# EAGLE design FINAL PROJECT (EAGLE 9.6.2)
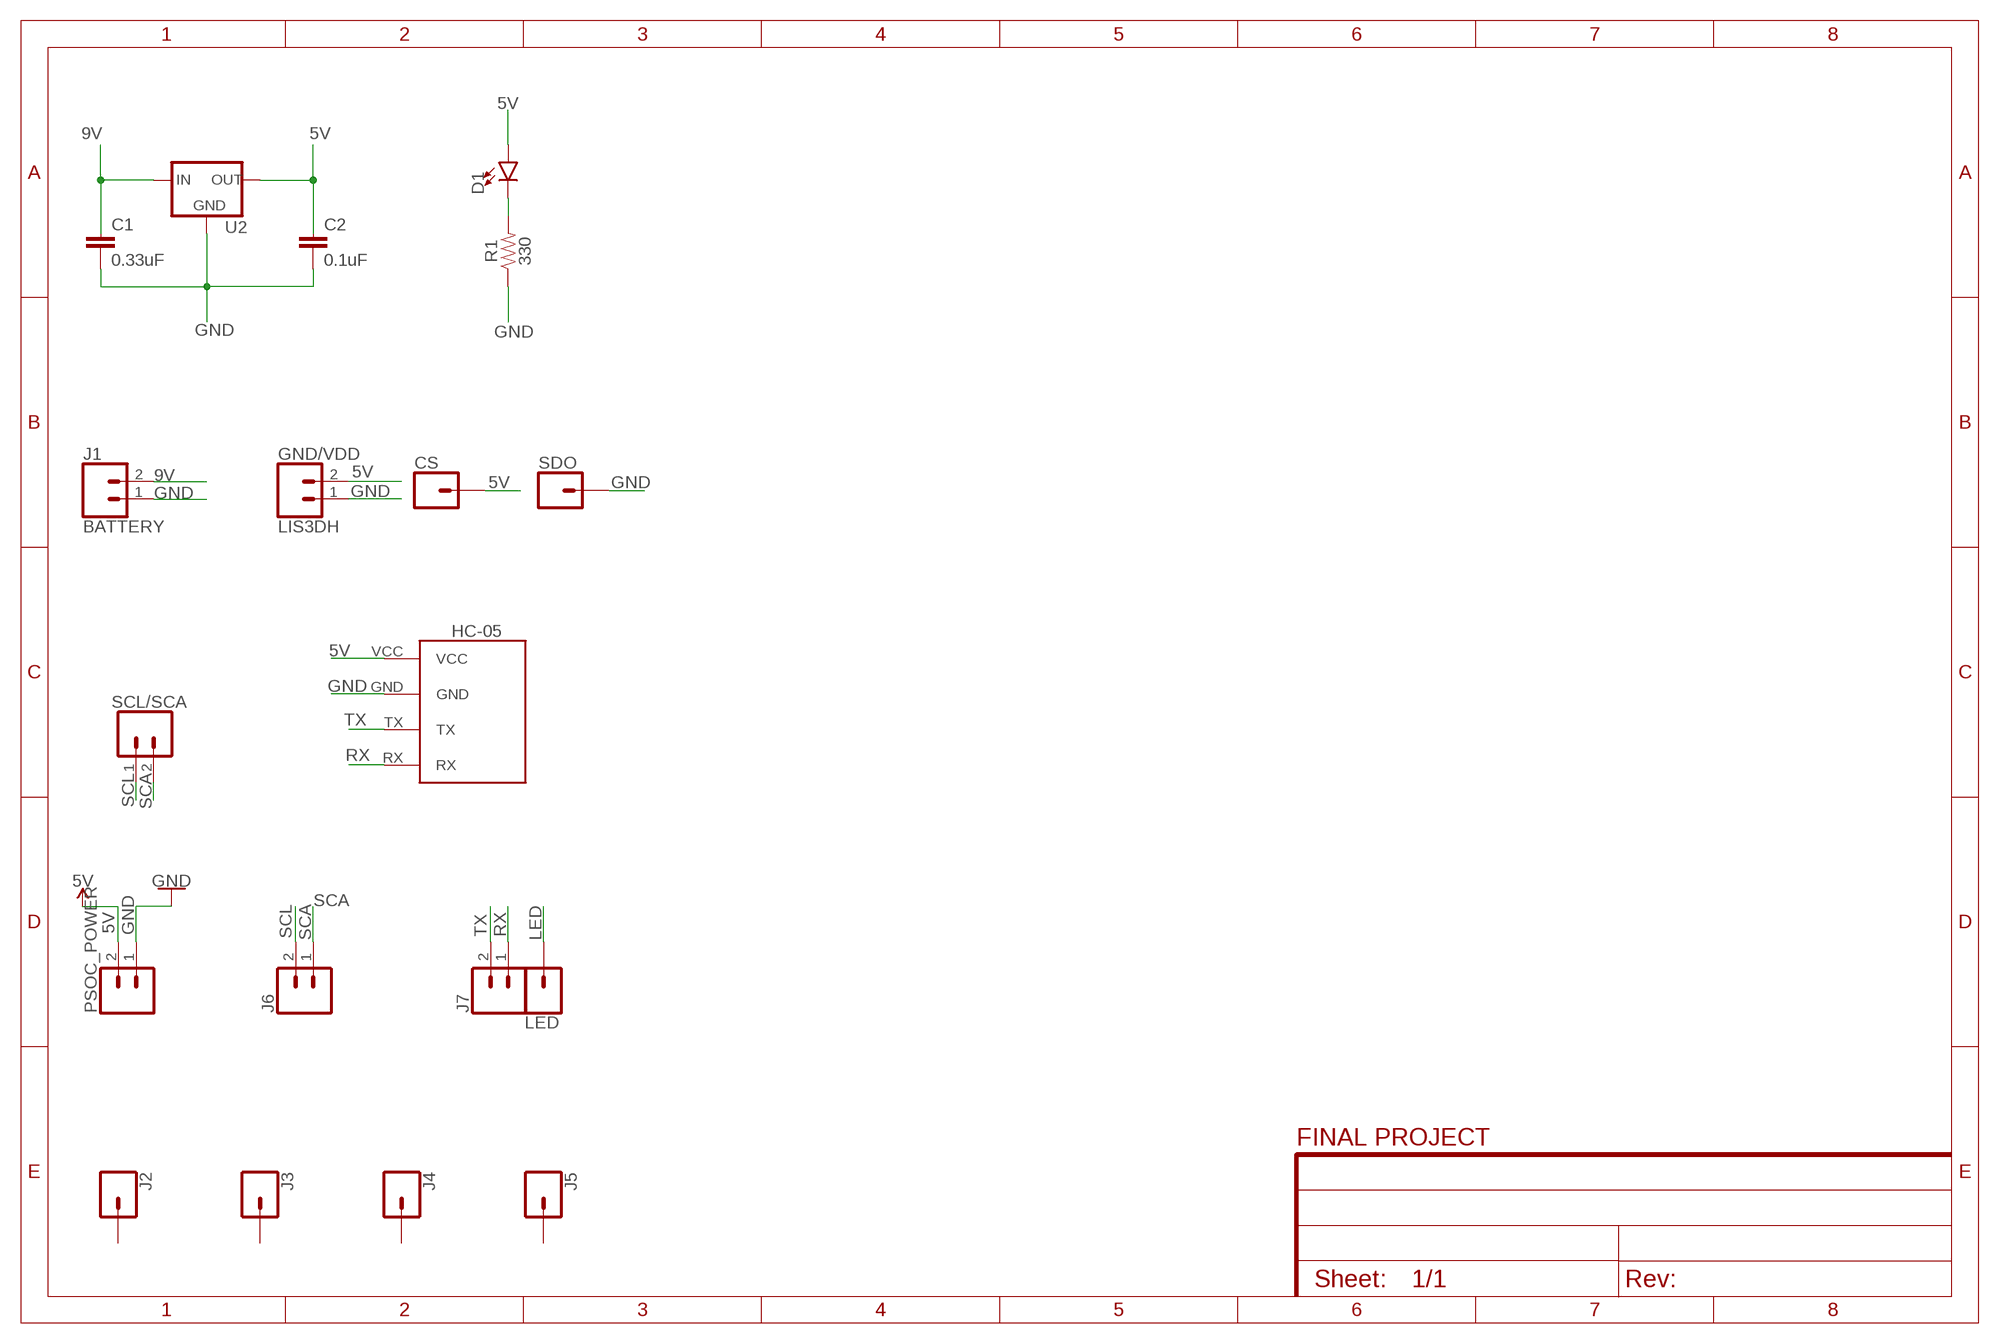
[diagram p0: schematic, sheet 1]

## Parts
C1  0.33uF  0.1UF-KIT-EZ-50V-20%  [CAP-PTH-SMALL-KIT]
C2  0.1uF  0.1UF-KIT-EZ-50V-20%  [CAP-PTH-SMALL-KIT]
CS  CONN_01  [1X01]
D1  LED3MM  [LED_3MM]
GND/VDD  LIS3DH  CONN_02  [1X02]
HC-05  BLUETOOTH_BOARD  [BT_BOARD_FOOTPRINT]
J1  BATTERY  CONN_02  [1X02]
J2  CONN_01  [1X01]
J3  CONN_01  [1X01]
J4  CONN_01  [1X01]
J5  CONN_01  [1X01]
J6  CONN_02  [1X02]
J7  CONN_02  [1X02]
LED  CONN_01  [1X01]
PSOC_POWER  CONN_02  [1X02]
R1  330  330OHM-HORIZ-1/10W-5%  [AXIAL-0.3]
SCL/SCA  CONN_02  [1X02]
SDO  CONN_01  [1X01]
U2  V_REG_78XX-TO-220  [TO-220-ALT]

## Nets
5V: C2.1 CS.1 D1.A GND/VDD.2 HC-05.VCC PSOC_POWER.2 U2.OUT
9V: C1.1 J1.2 U2.IN
GND: C1.2 C2.2 GND/VDD.1 HC-05.GND J1.1 PSOC_POWER.1 R1.P$1 SDO.1 U2.GND
LED: LED.1
N$2: D1.K(C) R1.P$2
RX: HC-05.RX J7.1
SCA: J6.1 SCL/SCA.2
SCL: J6.2 SCL/SCA.1
TX: HC-05.TX J7.2
Unconnected: J2.1 J3.1 J4.1 J5.1

## Library data of the parts
C1 = SparkFun-Capacitors:0.1UF: 0.1µF ceramic capacitors A capacitor is a passive two-terminal electrical component used to store electrical energy temporarily in an electric field.; PROD_ID: CAP-08370; VALUE: 0.1uF
C2 = SparkFun-Capacitors:0.1UF: 0.1µF ceramic capacitors A capacitor is a passive two-terminal electrical component used to store electrical energy temporarily in an electric field.; PROD_ID: CAP-08370
CS J2-J5 LED SDO = SparkFun-Connectors:CONN_01: Single connection point. Often used as Generic Header-pin footprint for 0.1 inch spaced/style header connections On any of the 0.1 inch spaced packages, you can populate with these: Break Away Headers - Straight <https://www.sparkfun.com/products/116> (PRT-00116) Break Away Male Headers - Right Angle <https://www.sparkfun.com/products/553> (PRT-00553) Female Headers <https://www.sparkfun.com/products/115> (PRT-00115) Break Away Headers - Machine Pin <https://www.sparkfun.com/products/117> (PRT-00117) Break Away Female Headers - Swiss Machine Pin <https://www.sparkfun.com/products/743> (PRT-00743) This device is also useful as a general connection point to wire up your design to another part of your project. Our various solder wires solder well into these plated through hole pads. Hook-Up Wire - Assortment (Stranded, 22 AWG) <https://www.sparkfun.com/products/11375> (PRT-11375) Hook-Up Wire - Assortment (Solid Core, 22 AWG) <https://www.sparkfun.com/products/11367> (PRT-11367) View the entire wire category on our website here <https://www.sparkfun.com/categories/141> Special notes: SMTSO-256-ET is a "flush mount" nut for a 4-40 screw. We mostly use this on specialty testbeds; it is a nice way to connect hardware to your PCB at an adjustable hieght. Also note, the SNAP packages are for using a snappable style connector. We sell a baggie of snaps and they are also used on two LilyPad designs: Snap Assortment - 30 pack (male and female) <https://www.sparkfun.com/products/11347> (DEV-11347) LilyPad Arduino SimpleSnap <https://www.sparkfun.com/products/10941> (DEV-10941) LilyPad SimpleSnap Protoboard <https://www.sparkfun.com/products/10940> (DEV-10940)
D1 = SparkFun-LED:LED: LED (Generic) Standard schematic elements and footprints for 5mm, 3mm, 1206, and 0603 sized LEDs. Generic LEDs with no color specified.; PROD_ID: DIO-08794
GND/VDD J1 J6 J7 PSOC_POWER SCL/SCA = SparkFun-Connectors:CONN_02: Multi connection point. Often used as Generic Header-pin footprint for 0.1 inch spaced/style header connections On any of the 0.1 inch spaced packages, you can populate with these: Break Away Headers - Straight <https://www.sparkfun.com/products/116> (PRT-00116) Break Away Male Headers - Right Angle <https://www.sparkfun.com/products/553> (PRT-00553) Female Headers <https://www.sparkfun.com/products/115> (PRT-00115) Break Away Headers - Machine Pin <https://www.sparkfun.com/products/117> (PRT-00117) Break Away Female Headers - Swiss Machine Pin <https://www.sparkfun.com/products/743> (PRT-00743) For SCREWTERMINALS and SPRING TERMINALS visit here: Screw Terimnals on SparkFun.com <https://www.sparkfun.com/search/results?term=Screw+Terminals> (5mm/3.5mm/2.54mm spacing) This device is also useful as a general connection point to wire up your design to another part of your project. Our various solder wires solder well into these plated through hole pads. Hook-Up Wire - Assortment (Stranded, 22 AWG) <https://www.sparkfun.com/products/11375> (PRT-11375) Hook-Up Wire - Assortment (Solid Core, 22 AWG) <https://www.sparkfun.com/products/11367> (PRT-11367) View the entire wire category on our website here <https://www.sparkfun.com/categories/141> Special notes: Molex polarized connector foot print use with: PRT-08233 with associated crimp pins and housings. 2.54_SCREWTERM for use with PRT-10571. 3.5mm Screw Terminal footprints for PRT-08084 5mm Screw Terminal footprints for use with PRT-08432
HC-05 = Bluetooth HC-05:BLUETOOTH_BOARD: Bluetooth Board V1.05
R1 = SparkFun-Resistors:330OHM: 330Ω resistor A resistor is a passive two-terminal electrical component that implements electrical resistance as a circuit element. Resistors act to reduce current flow, and, at the same time, act to lower voltage levels within circuits. - Wikipedia; PROD_ID: RES-8371
U2 = SparkFun-IC-Power:V_REG_78XX: Voltage Regulator Standard 78xx regulator. IGO (Input Ground Output). Spark Fun Electronics SKU : COM-00107; PROD_ID: VREG-08450; SF_ID: COM-00107

## Board
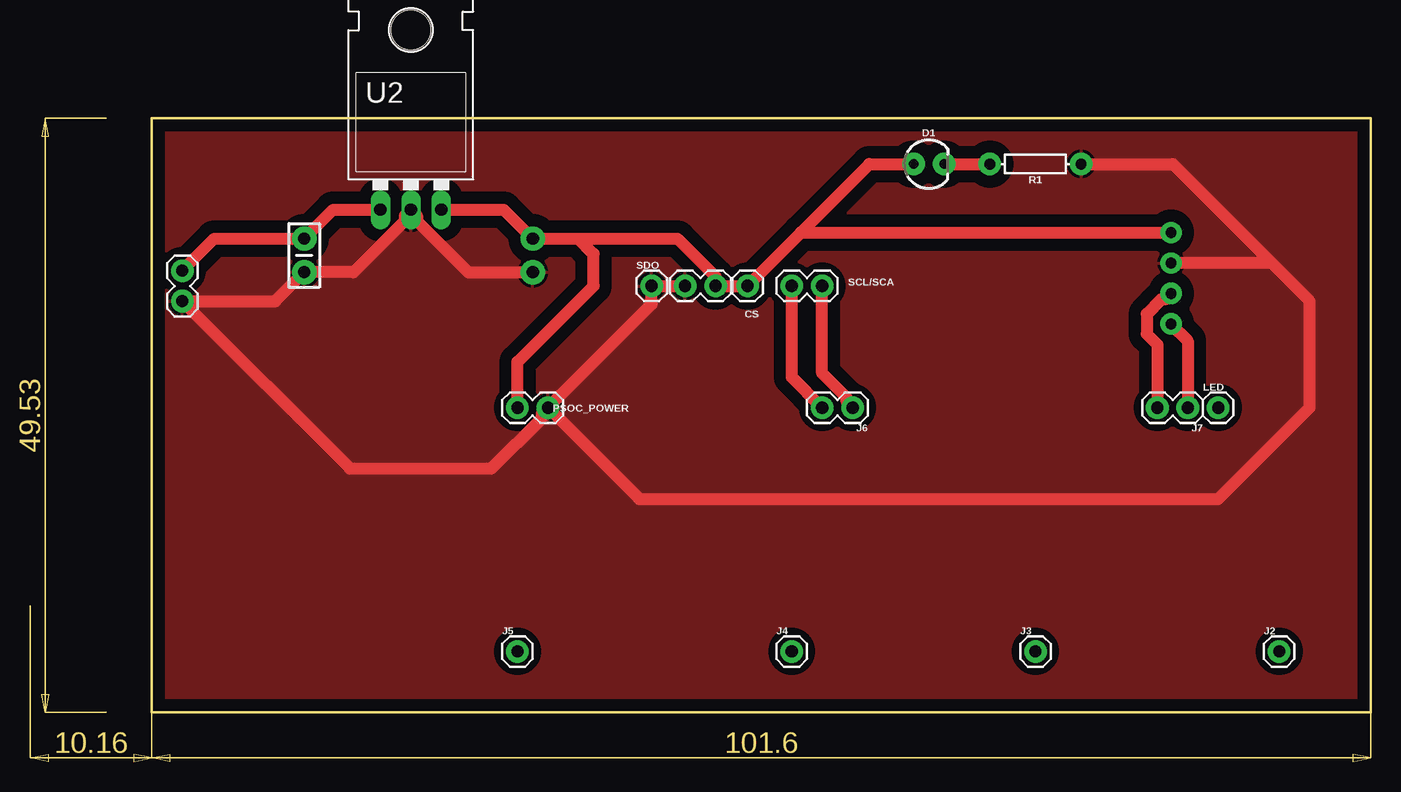
[diagram p1: board, top side]
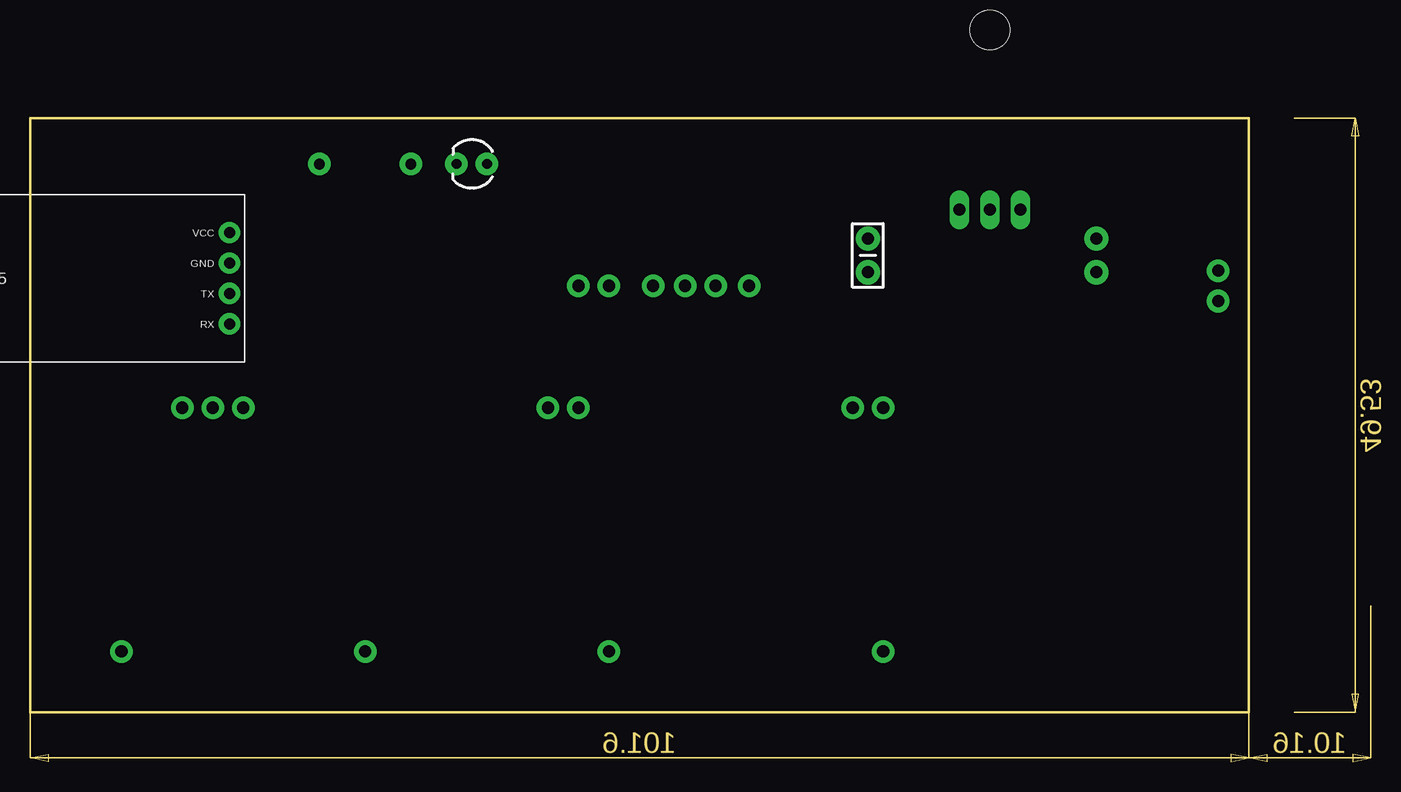
[diagram p2: board, bottom side, seen from below]

Size 101.6 x 49.53 mm. Coordinates in mm from the lower left corner, seen from the top.
Outline: 0,0 0,49.53 101.6,49.53 101.6,0 0,0
Copper layers (1*16): Top 0.035mm / dielectric 1.5mm / Bottom 0.035mm
Design rules "sparkfun *": minimum track width 40mil, minimum drill 20mil, track to track 40mil, track to pad 8mil, pad to pad 8mil, via to via 8mil, smd to smd 8mil, copper to edge 8mil, drill to drill 8mil, minimum pad ring 12mil, minimum via ring 10mil, stop-mask expansion 4mil, vias tented up to drill 20mil, thermal gap 10mil

### Footprints (pad centres in the part's own frame; a part is rotated, then mirrored left to right if it is on the bottom)
CAP-PTH-SMALL-KIT = drill 1.016 pad 2.032: 1 -1.397,0; 2 1.397,0
1X01 = drill 1.016 pad 1.88: 1 0,0
LED_3MM = drill 0.813 pad 1.88: A -1.27,0; K 1.27,0
1X02 = drill 1.016 pad 1.88: 1 0,0; 2 2.54,0
BT_BOARD_FOOTPRINT = drill 0.9 pad 1.778: GND -16.51,-1.27; RX -16.51,3.81; TX -16.51,1.27; VCC -16.51,-3.81
AXIAL-0.3 = drill 0.9 pad 1.88: P$1 -3.81,0; P$2 3.81,0
TO-220-ALT = drill 1.016 long: GND 0,-3.81; IN -2.54,-3.81; OUT 2.54,-3.81 | hole 3.302: 0,11.176

### Placement (x,y rotation side)
C1  12.7,38.1 270 top
C2  31.75,38.1 270 bottom
CS  49.66,35.56 0 top
D1  64.77,45.72 0 top
GND/VDD  44.45,35.56 0 top
HC-05  101.47,36.2 180 bottom
J1  2.54,34.29 90 top
J2  93.98,5.08 0 top
J3  73.66,5.08 0 top
J4  53.34,5.08 0 top
J5  30.48,5.08 0 top
J6  58.42,25.4 180 top
J7  86.36,25.4 180 top
LED  88.9,25.4 0 top
PSOC_POWER  33.02,25.4 180 top
R1  73.66,45.72 180 top
SCL/SCA  53.34,35.56 0 top
SDO  41.66,35.56 0 top
U2  21.59,45.72 0 top

### Tracks (layer width: path | path; a pad name or v marks a point on that pad's centre or on a via)
5V
  Top 1.016: U2.OUT 29.34,41.91 C2.1 35.56,39.5 | PSOC_POWER.2 30.48,29.21 36.83,35.56 36.83,38.23 35.56,39.5 | 35.56,39.5 43.81,39.5 46.99,36.32 GND/VDD.2 CS.1 54.1,40.01 | 54.1,40.01 HC-05.VCC | 54.1,40.01 59.82,45.72 D1.A
9V
  Top 1.016: J1.2 5.21,39.5 C1.1 15.11,41.91 U2.IN
GND
  Top 1.016: GND/VDD.1 SDO.1 41.66,34.04 PSOC_POWER.1 | PSOC_POWER.1 32.51,24.89 32.51,24.56 28.27,20.32 16.51,20.32 J1.1 10.29,34.29 C1.2 16.81,36.7 21.08,40.97 21.08,41.4 U2.GND 22.1,41.4 22.1,40.97 26.37,36.7 C2.2 | PSOC_POWER.1 40.64,17.78 88.9,17.78 96.52,25.4 96.52,34.29 93.34,37.47 | 93.34,37.47 HC-05.GND | R1.P$1 85.09,45.72 93.34,37.47
  pour Top (isolate 1): 0,0 101.6,0 101.6,49.53 0,49.53
N$2
  Top 1.016: D1.K R1.P$2
RX
  Top 1.016: HC-05.RX 86.36,30.99 J7.1
SCA
  Top 1.016: SCL/SCA.2 55.88,28.27 57.91,26.24 57.91,25.91 J6.1
SCL
  Top 1.016: SCL/SCA.1 53.34,27.94 J6.2
TX
  Top 1.016: HC-05.TX 84.45,34.42 84.12,34.42 82.93,33.23 82.93,31.54 83.82,30.65 J7.2